# EAGLE design ee392 (EAGLE 5.01)
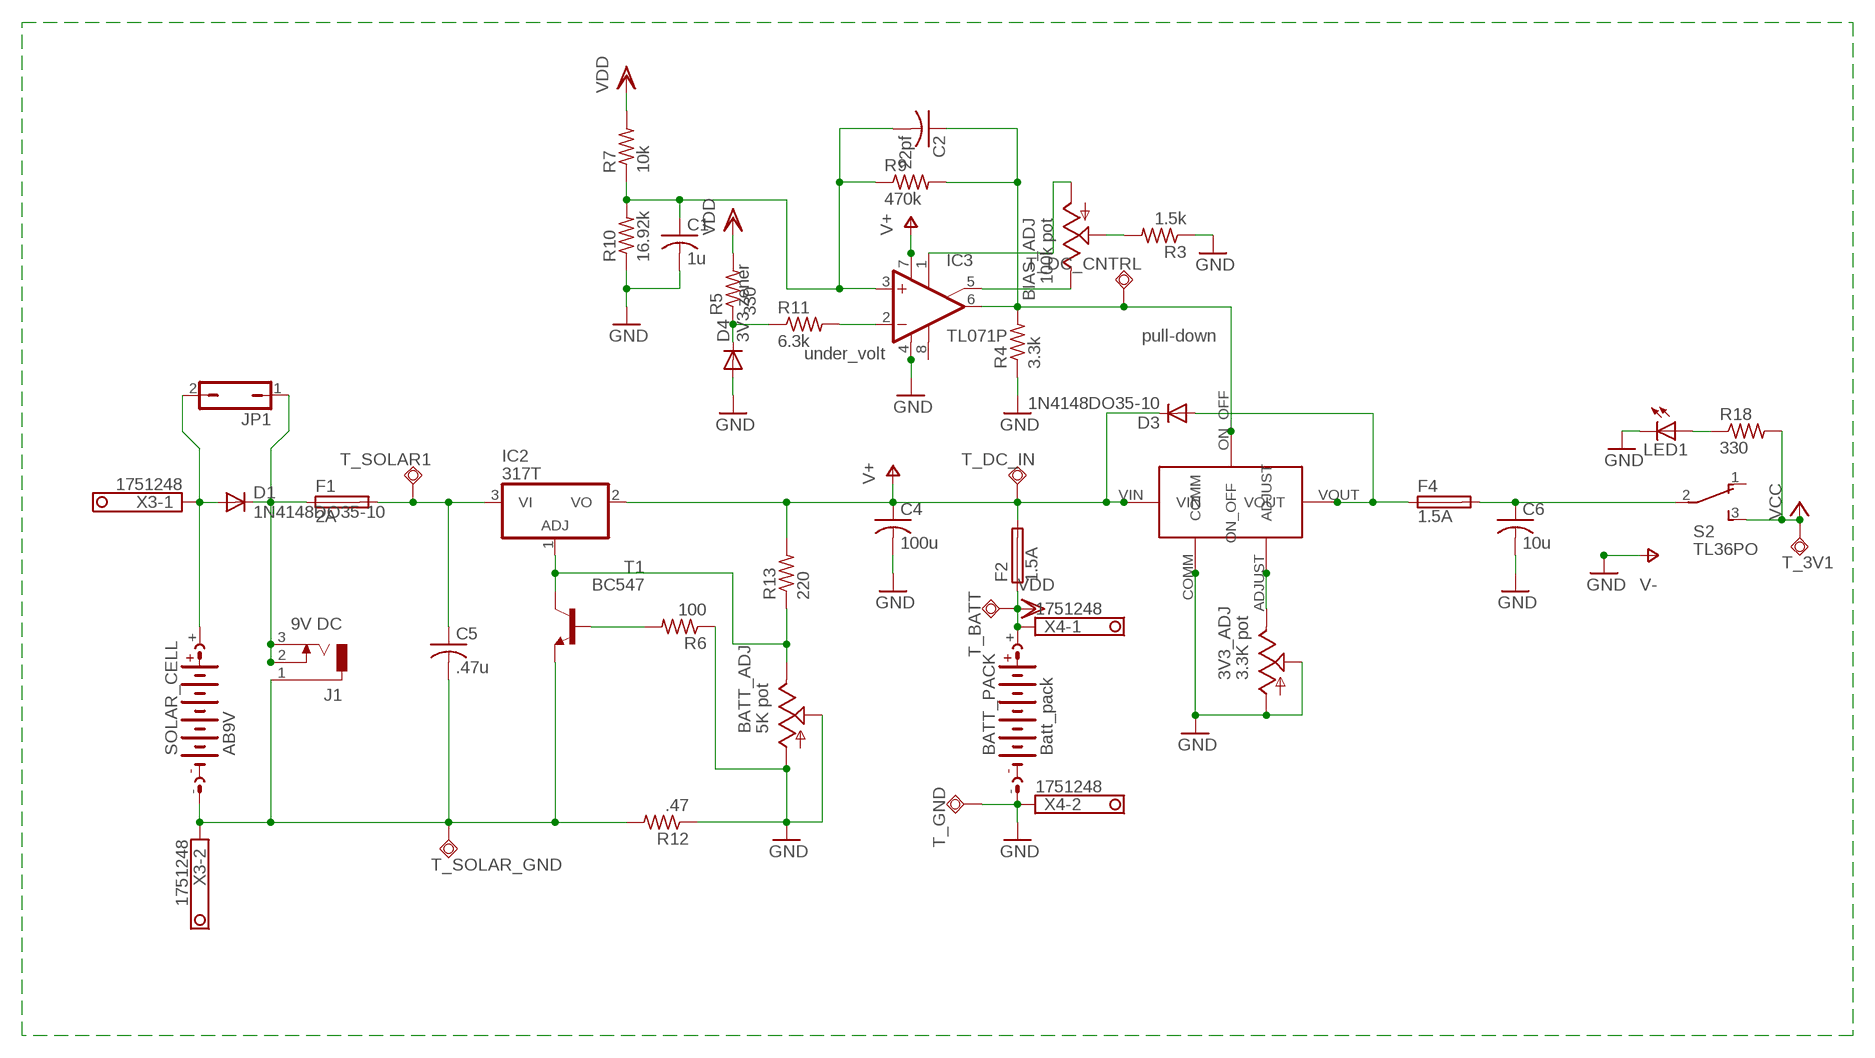
[diagram p0: schematic, sheet 1, part 1 of 2]
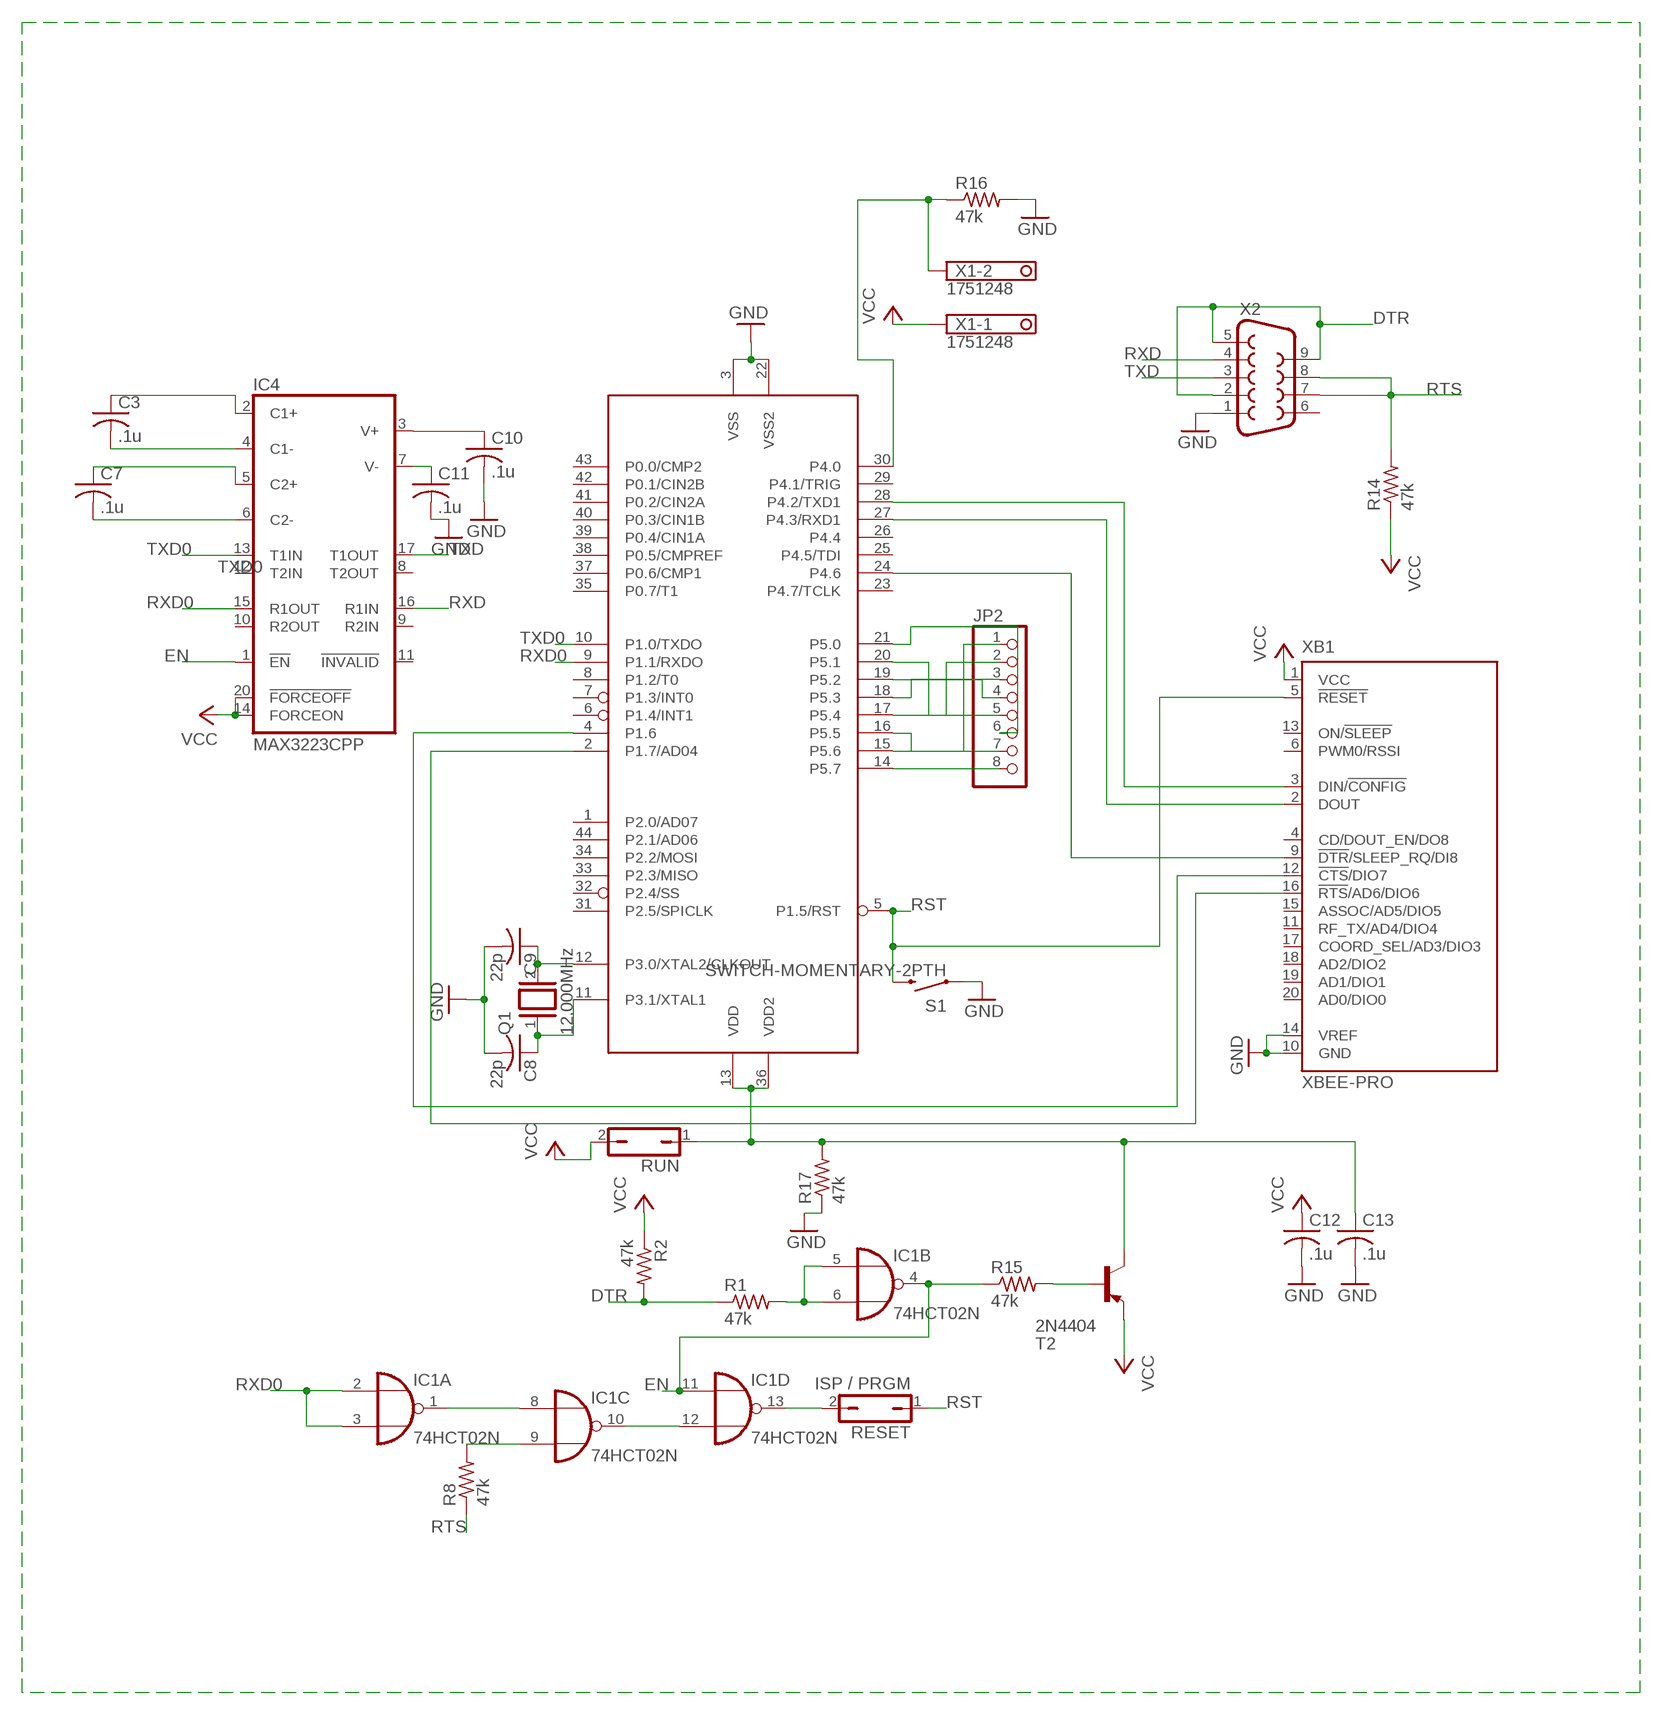
[diagram p1: schematic, sheet 1, part 2 of 2]

## Parts
3V3_ADJ  3.3K pot  TRIM_US-B25V  [B25V]
BATT_ADJ  5K pot  TRIM_US-B25V  [B25V]
BATT_PACK  Batt_pack  AB9V  [AB9V]
BIAS_ADJ  100k pot  TRIM_US-B25V  [B25V]
C1  1u  C-US050-045X075  [C050-045X075]
C2  22pf  C-US025-050X050  [C025-050X050]
C3  .1u  C-US025-050X050  [C025-050X050]
C4  100u  C-US050-045X075  [C050-045X075]
C5  .47u  C-US025-050X050  [C025-050X050]
C6  10u  C-US050-045X075  [C050-045X075]
C7  .1u  C-US025-050X050  [C025-050X050]
C8  22p  C-US025-050X050  [C025-050X050]
C9  22p  C-US025-050X050  [C025-050X050]
C10  .1u  C-US025-050X050  [C025-050X050]
C11  .1u  C-US025-050X050  [C025-050X050]
C12  .1u  C-US025-050X050  [C025-050X050]
C13  .1u  C-US025-050X050  [C025-050X050]
D1  1N4148DO35-10  [DO35-10]
D3  1N4148DO35-10  [DO35-10]
D4  3V3 zener  DIODE-DO35-10  [DO35-10]
F1  2A  FUSE19560  [19560]
F2  1.5A  FUSE19560  [19560]
F4  1.5A  FUSE19560  [19560]
IC1  74HCT02N  [DIL14]
IC2  317T  [TO220H]
IC3  TL071P  [DIL08]
IC4  MAX3223CPP  [DIL20]
J1  9V DC  DCJ0202  [DCJ0202]
JP1  JP1Q  [JP1]
JP2  PINHD-1X8  [1X08]
LED1  LED5MM  [LED5MM]
Q1  12.000MHz  XTAL/S  [QS]
R1  47k  R-US_0204/7  [0204/7]
R2  47k  R-US_0204/7  [0204/7]
R3  1.5k  R-US_0204/7  [0204/7]
R4  3.3k  R-US_0204/7  [0204/7]
R5  330  R-US_0204/7  [0204/7]
R6  100  R-US_0204/7  [0204/7]
R7  10k  R-US_0204/7  [0204/7]
R8  47k  R-US_0204/7  [0204/7]
R9  470k  R-US_0204/7  [0204/7]
R10  16.92k  R-US_0204/7  [0204/7]
R11  6.3k  R-US_0204/7  [0204/7]
R12  .47  R-US_0204/7  [0204/7]
R13  220  R-US_0204/7  [0204/7]
R14  47k  R-US_0204/7  [0204/7]
R15  47k  R-US_0204/7  [0204/7]
R16  47k  R-US_0204/7  [0204/7]
R17  47k  R-US_0204/7  [0204/7]
R18  330  R-US_0204/7  [0204/7]
RESET  ISP / PRGM  JP1Q  [JP1]
RUN  JP1Q  [JP1]
S1  SWITCH-MOMENTARY-2PTH  [TACTILE-PTH]
S2  TL36PO  [TL3XPO]
SOLAR_CELL  AB9V  [AB9V]
T1  BC547  [TO92]
T2  2N4404  -PNP-TO92-EBC  [TO92-EBC]
T_3V1  TPSQPAD1-20  [P1-20]
T_BATT  TPSQPAD1-20  [P1-20]
T_DC_CNTRL  TPSQPAD1-20  [P1-20]
T_DC_IN  TPSQPAD1-20  [P1-20]
T_GND  TPSQPAD1-20  [P1-20]
T_SOLAR1  TPSQPAD1-20  [P1-20]
T_SOLAR_GND  TPSQPAD1-20  [P1-20]
U$1  LPC954  [LPC954]
U$2  V_REG2  [V_REG2]
X1  1751248  [1751248]
X2  DB9MALE  [DB9]
X3  1751248  [1751248]
X4  1751248  [1751248]
XB1  XBEE-PRO  [XBEE-PRO]

## Nets
DTR: R1.1 R2.2 X2.2 X2.5 X2.9
EN: IC1.4(B:O) IC1.11(D:I0) IC4.1(!EN) R15.1
GND: 3V3_ADJ.A 3V3_ADJ.S BATT_ADJ.A BATT_ADJ.S BATT_PACK.- C1.2 C4.2 C6.2 C8.2 C9.2 C10.2 C11.2 C12.2 C13.2 D4.A IC3.4(V-) LED1.K(C) R3.1 R4.1 R6.1 R10.1 R12.1 R16.2 R17.1 S1.1 T_GND.1(TP) U$1.3(VSS) U$1.22(VSS2) U$2.COMM X2.1 X4.2 XB1.10(GND) XB1.14(VREF) ; supply symbol labelled V-
N$1: C5.2 J1.1 R12.2 SOLAR_CELL.- T1.1(E) T_SOLAR_GND.1(TP) X3.2
N$2: D1.A JP1.2 SOLAR_CELL.+ X3.1
N$3: D1.C F1.1 J1.2 J1.3 JP1.1
N$4: BIAS_ADJ.S R3.2
N$5: BIAS_ADJ.E IC3.5(ON2)
N$6: C1.1 C2.2 IC3.3(+IN) R7.1 R9.1 R10.2
N$7: IC3.2(-IN) R11.2
N$8: BIAS_ADJ.A IC3.1(ON1)
N$9: D4.C R5.1 R11.1
N$10: C3.1 IC4.2(C1+)
N$11: C5.1 F1.2 IC2.3(VI) T_SOLAR1.1(TP)
N$12: C3.2 IC4.4(C1-)
N$13: JP2.6 U$1.21(P5.0)
N$14: BATT_ADJ.E IC2.1(ADJ) R13.1 T1.3(C)
N$15: R6.2 T1.2(B)
N$16: C7.1 IC4.5(C2+)
N$17: C7.2 IC4.6(C2-)
N$18: IC1.1(A:O) IC1.8(C:I0)
N$19: IC1.9(C:I1) R8.2
N$20: IC1.10(C:O) IC1.12(D:I1)
N$21: IC1.13(D:O) RESET.2
N$22: IC1.5(B:I0) IC1.6(B:I1) R1.2
N$23: C13.1 R17.2 RUN.1 T2.C U$1.13(VDD) U$1.36(VDD2)
N$24: R15.2 T2.B
N$26: C9.1 Q1.2 U$1.12(P3.0/XTAL2/CLKOUT)
N$27: C8.1 Q1.1 U$1.11(P3.1/XTAL1)
N$29: C10.1 IC4.3(V+)
N$30: C11.1 IC4.7(V-)
N$31: U$1.28(P4.2/TXD1) XB1.3(DIN/!CONFIG)
N$32: U$1.27(P4.3/RXD1) XB1.2(DOUT)
N$33: R16.1 U$1.30(P4.0) X1.2
N$34: JP2.5 U$1.20(P5.1)
N$35: JP2.4 U$1.19(P5.2)
N$36: JP2.3 U$1.18(P5.3)
N$37: JP2.2 U$1.17(P5.4)
N$38: JP2.7 U$1.16(P5.5)
N$39: JP2.1 U$1.15(P5.6)
N$40: JP2.8 U$1.14(P5.7)
N$42: U$1.24(P4.6) XB1.9(!DTR!/SLEEP_RQ/DI8)
N$43: U$1.2(P1.7/AD04) XB1.16(!RTS!/AD6/DIO6)
N$44: U$1.4(P1.6) XB1.12(!CTS!/DIO7)
N$45: LED1.A R18.1
N$46: C6.1 F4.2 S2.2(P)
ON_OFF: C2.1 IC3.6(OUT) R4.2 R9.2 T_DC_CNTRL.1(TP) U$2.ON_OFF
R_TRIMM: 3V3_ADJ.E U$2.ADJUST
RST: RESET.1 S1.3 U$1.5(P1.5/RST) XB1.5(!RESET)
RTS: R8.1 R14.2 X2.7 X2.8
RXD: IC4.16(R1IN) X2.4
RXD0: IC1.2(A:I0) IC1.3(A:I1) IC4.15(R1OUT) U$1.9(P1.1/RXDO)
TXD: IC4.17(T1OUT) X2.3
TXD0: IC4.13(T1IN) U$1.10(P1.0/TXDO)
V+: C4.1 D3.C F2.2 IC2.2(VO) IC3.7(V+) R13.2 T_DC_IN.1(TP) U$2.VIN
VCC: C12.1 IC4.14(FORCEON) IC4.20(!FORCEOFF) R2.1 R14.1 R18.2 RUN.2 S2.3(S) T2.E T_3V1.1(TP) X1.1 XB1.1(VCC)
VDD: BATT_PACK.+ F2.1 R5.2 R7.2 T_BATT.1(TP) X4.1
VOUT: D3.A F4.1 U$2.VOUT
Unconnected: IC3.8(OPT) IC4.8(T2OUT) IC4.9(R2IN) IC4.10(R2OUT) IC4.11(!INVALID) IC4.12(T2IN) S2.1(O) U$1.1(P2.0/AD07) U$1.6(P1.4/INT1) U$1.7(P1.3/INT0) U$1.8(P1.2/T0) U$1.23(P4.7/TCLK) U$1.25(P4.5/TDI) U$1.26(P4.4) U$1.29(P4.1/TRIG) U$1.31(P2.5/SPICLK) U$1.32(P2.4/SS) U$1.33(P2.3/MISO) U$1.34(P2.2/MOSI) U$1.35(P0.7/T1) U$1.37(P0.6/CMP1) U$1.38(P0.5/CMPREF) U$1.39(P0.4/CIN1A) U$1.40(P0.3/CIN1B) U$1.41(P0.2/CIN2A) U$1.42(P0.1/CIN2B) U$1.43(P0.0/CMP2) U$1.44(P2.1/AD06) X2.6 XB1.4(CD/DOUT_EN/DO8) XB1.6(PWM0/RSSI) XB1.11(RF_TX/AD4/DIO4) XB1.13(ON/!SLEEP) XB1.15(ASSOC/AD5/DIO5) XB1.17(COORD_SEL/AD3/DIO3) XB1.18(AD2/DIO2) XB1.19(AD1/DIO1) XB1.20(AD0/DIO0)

## Notes on the sheet
- pull-down
- under_volt

## Power pins joined to a net without a drawn wire
GND: IC1.7(P:GND) IC4.18(GND)
VCC: IC1.14(P:VCC) IC4.19(VCC)

## Library data of the parts
3V3_ADJ BATT_ADJ BIAS_ADJ = pot:TRIM_US-: POTENTIOMETER
BATT_PACK SOLAR_CELL = battery:AB9V: 9-V BATTERY CLIP
C1-C13 = rcl:C-US: CAPACITOR, American symbol
D1 D3 = diode:1N4148: DIODE high speed (Philips)
D4 = diode:DIODE-: DIODE
F1 F2 F4 = fuse:FUSE: Fuse
IC1 = 74xx-eu:74*02: Quad 2-input NOR gate
IC2 = linear:*317: Positive VOLTAGE REGULATOR
IC3 = linear:TL071: OP AMP
IC4 = maxim:MAX3223*: RS-232 Transceivers with AutoShutdown 1µA Supply-Current, True +3V to +5.5V http://dbserv.maxim-ic.com/
J1 = con-jack:DCJ0202: DC POWER JACK Source: DCJ0202.pdf
JP1 RESET RUN = jumper:JP1Q: JUMPER
JP2 = pinhead:PINHD-1X8: PIN HEADER
LED1 = led:LED: LED OSRAM: - CHIPLED LG R971, LG N971, LY N971, LG Q971, LY Q971, LO R971, LY R971 LH N974, LH R974 LS Q976, LO Q976, LY Q976 LO Q996 - Hyper CHIPLED LW Q18S LB Q993, LB Q99A, LB R99A - SideLED LS A670, LO A670, LY A670, LG A670, LP A670 LB A673, LV A673, LT A673, LW A673 LH A674 LY A675 LS A676, LA A676, LO A676, LY A676, LW A676 LS A679, LY A679, LG A679 - Hyper Micro SIDELED® LS Y876, LA Y876, LO Y876, LY Y876 LT Y87S - SmartLED LW L88C, LW L88S LB L89C, LB L89S, LG L890 LS L89K, LO L89K, LY L89K LS L896, LA L896, LO L896, LY L896 - TOPLED LS T670, LO T670, LY T670, LG T670, LP T670 LSG T670, LSP T670, LSY T670, LOP T670, LYG T670 LG T671, LOG T671, LSG T671 LB T673, LV T673, LT T673, LW T673 LH T674 LS T676, LA T676, LO T676, LY T676, LB T676, LH T676, LSB T676, LW T676 LB T67C, LV T67C, LT T67C, LS T67K, LO T67K, LY T67K, LW E67C LS E67B, LA E67B, LO E67B, LY E67B, LB E67C, LV E67C, LT E67C LW T67C LS T679, LY T679, LG T679 LS T770, LO T770, LY T770, LG T770, LP T770 LB T773, LV T773, LT T773, LW T773 LH T774 LS E675, LA E675, LY E675, LS T675 LS T776, LA T776, LO T776, LY T776, LB T776 LHGB T686 LT T68C, LB T68C - Hyper Mini TOPLED® LB M676 - Mini TOPLED Santana® LG M470 LS M47K, LO M47K, LY M47K Source: http://www.osram.convergy.de LUXEON: - LUMILED® LXK2-PW12-R00, LXK2-PW12-S00, LXK2-PW14-U00, LXK2-PW14-V00 LXK2-PM12-R00, LXK2-PM12-S00, LXK2-PM14-U00 LXK2-PE12-Q00, LXK2-PE12-R00, LXK2-PE12-S00, LXK2-PE14-T00, LXK2-PE14-U00 LXK2-PB12-K00, LXK2-PB12-L00, LXK2-PB12-M00, LXK2-PB14-N00, LXK2-PB14-P00, LXK2-PB14-Q00 LXK2-PR12-L00, LXK2-PR12-M00, LXK2-PR14-Q00, LXK2-PR14-R00 LXK2-PD12-Q00, LXK2-PD12-R00, LXK2-PD12-S00 LXK2-PH12-R00, LXK2-PH12-S00 LXK2-PL12-P00, LXK2-PL12-Q00, LXK2-PL12-R00 Source: www.luxeon.com KINGBRIGHT: KA-3528ASYC Source: www.kingbright.com
Q1 = special:XTAL/S: CRYSTAL
R1-R18 = resistor:R-US_: RESISTOR, American symbol
S1 = SparkFun:SWITCH-MOMENTARY-2
S2 = switch:TL36PO: TINY SWITCH ON - ON Source: http://www2.produktinfo.conrad.com/datenblaetter/700000-724999/705152-da-01-de-Subminiaturschalter_TL_36YO.pdf
T1 = transistor:BC547: NPN TRANSISTOR
T2 = transistor-neu-to92:*-PNP-: PNP Transistror
T_3V1 T_BATT T_DC_CNTRL T_DC_IN T_GND T_SOLAR1 T_SOLAR_GND = testpad:TPSQ: Test pad
U$1 = lpc954:LPC954
U$2 = murata-v_reg2:V_REG2
X1 X3 X4 = con-phoenix-350:1751248: MKDS 1/ 2-3,5 Printklemme Nennstrom: 10 A Bemessungsspannung: 160 V Raster: 3,5 mm Polzahl: 2 Montageart: Löten Anschlussart: Schraubanschluss Anschlussrichtung vom Leiter zur Platine: 0° Source: http://eshop.phoenixcontact.com .. 1751248.pdf
X2 = SparkFun:DB9: DB9 Connector Standard DB9 (D-Sub 9) serial connector. Can be used for CAN bus as well as RS485 and RS232. Footprint production proven. Spark Fun Electronics SKU : PRT-00429
XB1 = maxstream:XBEE: XBee (TM) /XBee-PRO(TM) OEM RF Modules Source: MaxStream, Inc. xbee_productmanual.pdf

## Board
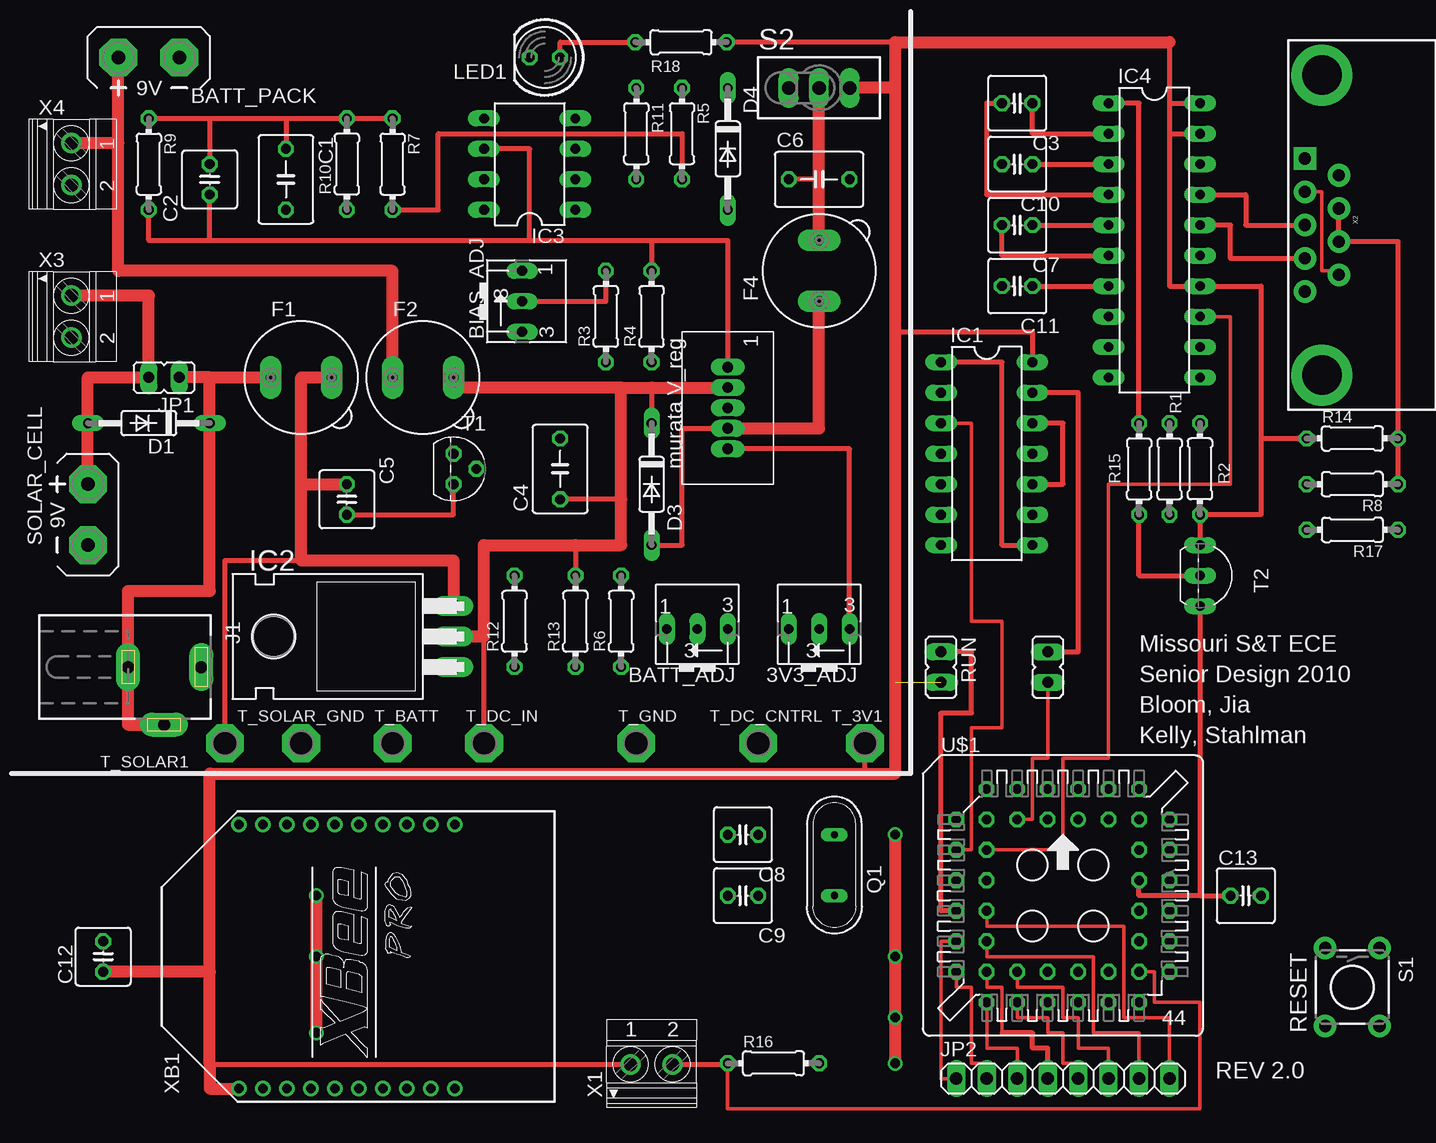
[diagram p2: board, top side]
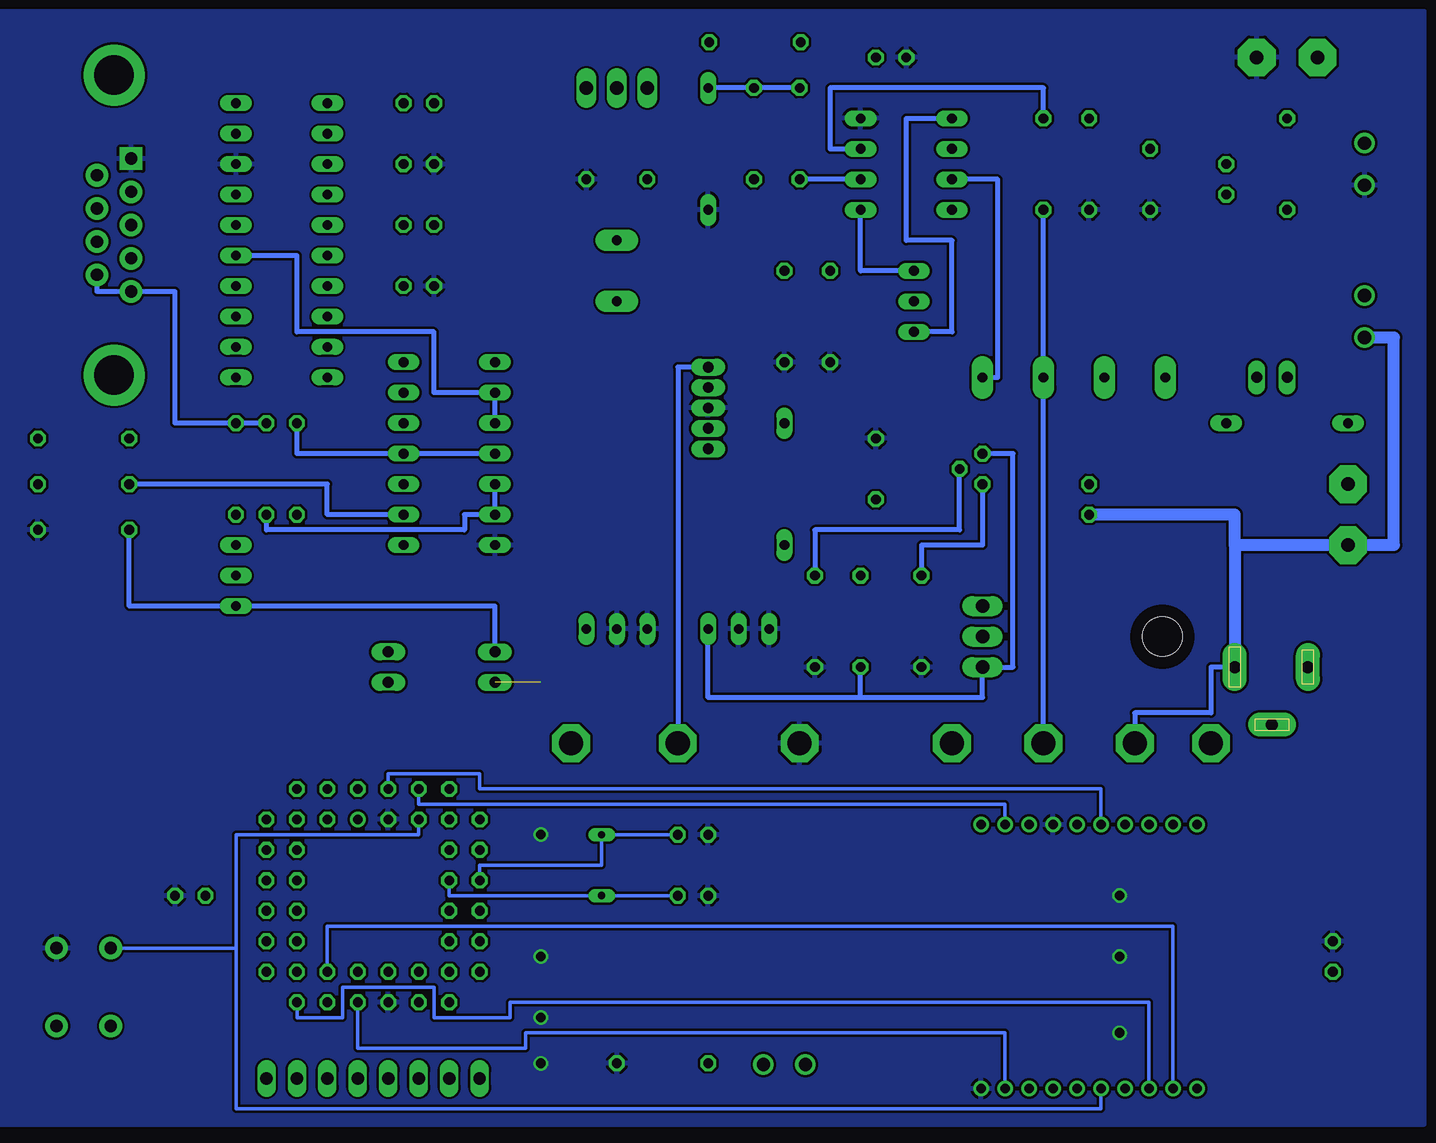
[diagram p3: board, bottom side, seen from below]

No outline drawn. Coordinates in mm, seen from the top.
Copper layers (1*16): Top 0.035mm / dielectric 1.5mm / Bottom 0.035mm
Design rules "default": minimum track width 10mil, minimum drill 24mil, track to track 8mil, track to pad 8mil, pad to pad 8mil, via to via 8mil, smd to smd 8mil, copper to edge 40mil, drill to drill 8mil, minimum pad ring 10mil, minimum via ring 8mil, stop-mask expansion 4mil, vias tented up to drill 0mil, thermal gap 10mil

### Footprints (pad centres in the part's own frame; a part is rotated, then mirrored left to right if it is on the bottom)
B25V = drill 0.813 long: A 2.54,0.635; E -2.54,0.635; S 0,0.635
AB9V = drill 1.118 pad 3.15 octagon: + 0,2.54; - 0,-2.54
C050-045X075 = drill 0.813 octagon: 1 -2.54,0; 2 2.54,0
C025-050X050 = drill 0.813 octagon: 1 -1.27,0; 2 1.27,0
DO35-10 = drill 0.813 long: A 5.08,0; C -5.08,0
19560 = drill 0.813 pad 1.778 long: 1 -2.54,0; 2 2.54,0
DIL14 = drill 0.813 long: 1 -7.62,-3.81; 2 -5.08,-3.81; 3 -2.54,-3.81; 4 0,-3.81; 5 2.54,-3.81; 6 5.08,-3.81; 7 7.62,-3.81; 8 7.62,3.81; 9 5.08,3.81; 10 2.54,3.81; 11 0,3.81; 12 -2.54,3.81; 13 -5.08,3.81; 14 -7.62,3.81
TO220H = drill 1.118 long: 1 -2.54,-10.16; 2 0,-10.16; 3 2.54,-10.16 | hole 3.302: 0,4.826
DIL08 = drill 0.813 long: 1 -3.81,-3.81; 2 -1.27,-3.81; 3 1.27,-3.81; 4 3.81,-3.81; 5 3.81,3.81; 6 1.27,3.81; 7 -1.27,3.81; 8 -3.81,3.81
DIL20 = drill 0.813 long: 1 -11.43,-3.81; 2 -8.89,-3.81; 3 -6.35,-3.81; 4 -3.81,-3.81; 5 -1.27,-3.81; 6 1.27,-3.81; 7 3.81,-3.81; 8 6.35,-3.81; 9 8.89,-3.81; 10 11.43,-3.81; 11 11.43,3.81; 12 8.89,3.81; 13 6.35,3.81; 14 3.81,3.81; 15 1.27,3.81; 16 -1.27,3.81; 17 -3.81,3.81; 18 -6.35,3.81; 19 -8.89,3.81; 20 -11.43,3.81
DCJ0202 = drill 1 pad 2 long: 1 0,3.1; 2 4.8,0; 3 0,-3
JP1 = drill 0.914 long: 1 0,-1.27; 2 0,1.27
1X08 = drill 1.016 long: 1 -8.89,0; 2 -6.35,0; 3 -3.81,0; 4 -1.27,0; 5 1.27,0; 6 3.81,0; 7 6.35,0; 8 8.89,0
LED5MM = drill 0.813 octagon: A -1.27,0; K 1.27,0
QS = drill 0.61 long: 1 -2.54,0; 2 2.54,0
0204/7 = drill 0.813 octagon: 1 -3.81,0; 2 3.81,0
TACTILE-PTH = drill 1.016 pad 1.88 round: 1 -3.251,2.261; 2 3.251,2.261; 3 -3.251,-2.261; 4 3.251,-2.261
TL3XPO = drill 1.1 pad 1.422 long: 1 -2.54,0; 2 0,0; 3 2.54,0
TO92 = drill 0.813 octagon: 1 1.27,0; 2 0,1.905; 3 -1.27,0
TO92-EBC = drill 0.813 long: B 0,-1.27; C 2.54,-1.27; E -2.54,-1.27
P1-20 = drill 2.007 pad 3.15 octagon: 1 0,0
LPC954 = drill 0.813 round: 1 1.27,6.35 | drill 0.813 octagon: 2 -1.27,8.89; 3 -1.27,6.35; 4 -3.81,8.89; 5 -3.81,6.35; 6 -6.35,8.89; 7 -8.89,6.35; 8 -6.35,6.35; 9 -8.89,3.81; 10 -6.35,3.81; 11 -8.89,1.27; 12 -6.35,1.27; 13 -8.89,-1.27; 14 -6.35,-1.27; 15 -8.89,-3.81; 16 -6.35,-3.81; 17 -8.89,-6.35; 18 -6.35,-8.89; 19 -6.35,-6.35; 20 -3.81,-8.89; 21 -3.81,-6.35; 22 -1.27,-8.89; 23 -1.27,-6.35; 24 1.27,-8.89; 25 1.27,-6.35; 26 3.81,-8.89; 27 3.81,-6.35; 28 6.35,-8.89; 29 8.89,-6.35; 30 6.35,-6.35; 31 8.89,-3.81; 32 6.35,-3.81; 33 8.89,-1.27; 34 6.35,-1.27; 35 8.89,1.27; 36 6.35,1.27; 37 8.89,3.81; 38 6.35,3.81; 39 8.89,6.35; 40 6.35,8.89; 41 6.35,6.35; 42 3.81,8.89; 43 3.81,6.35; 44 1.27,8.89
V_REG2 = drill 0.9 pad 1.27 long: ADJUST -3.4,0; COMM 0,0; ON_OFF 3.4,0; VIN 1.7,0; VOUT -1.7,0
1751248 = drill 1.1 pad 1.7 round: 1 -1.75,-0.1; 2 1.75,-0.1
DB9 = drill 1.016 pad 1.88 square: 1 -5.54,-1.42 | drill 1.016 pad 1.88 round: 2 -2.77,-1.42; 3 0,-1.42; 4 2.77,-1.42; 5 5.54,-1.42; 6 -4.15,1.42; 7 -1.38,1.42; 8 1.38,1.42; 9 4.15,1.42 | drill 3.302 pad 5.08 round: G1 -12.5,0; G2 12.5,0
XBEE-PRO = drill 0.8 pad 1.27 round: 1 -11,9; 2 -11,7; 3 -11,5; 4 -11,3; 5 -11,1; 6 -11,-1; 7 -11,-3; 8 -11,-5; 9 -11,-7; 10 -11,-9; 11 11,-9; 12 11,-7; 13 11,-5; 14 11,-3; 15 11,-1; 16 11,1; 17 11,3; 18 11,5; 19 11,7; 20 11,9

### Placement (x,y rotation side)
3V3_ADJ  71.12,15.24 180 top
BATT_ADJ  60.96,15.24 180 top
BATT_PACK  15.24,62.23 90 top
BIAS_ADJ  46.99,41.91 90 top
C1  26.67,52.07 270 top
C2  20.32,52.07 90 top
C3  87.63,58.42 180 top
C4  49.53,27.94 90 top
C5  31.75,25.4 270 top
C6  71.12,52.07 0 top
C7  87.63,48.26 180 top
C8  64.77,-2.54 180 top
C9  64.77,-7.62 180 top
C10  87.63,53.34 180 top
C11  87.63,43.18 180 top
C12  11.43,-12.7 90 top
C13  106.68,-7.62 0 top
D1  15.24,31.75 180 top
D3  57.15,26.67 270 top
D4  63.5,54.61 270 top
F1  27.94,35.56 0 top
F2  38.1,35.56 0 top
F4  71.12,44.45 90 top
IC1  85.09,29.21 270 top
IC2  30.48,13.97 90 top
IC3  46.99,53.34 90 top
IC4  99.06,46.99 270 top
J1  16.51,11.43 270 top
JP1  16.51,35.56 90 top
JP2  91.44,-22.86 0 top
LED1  48.26,62.23 180 top
Q1  72.39,-5.08 270 top
R1  100.33,27.94 270 top
R2  102.87,27.94 90 top
R3  53.34,40.64 90 top
R4  57.15,40.64 90 top
R5  59.69,55.88 270 top
R6  54.61,15.24 90 top
R7  35.56,53.34 270 top
R8  115.57,26.67 180 top
R9  15.24,53.34 270 top
R10  31.75,53.34 90 top
R11  55.88,55.88 270 top
R12  45.72,15.24 90 top
R13  50.8,15.24 90 top
R14  115.57,30.48 0 top
R15  97.79,27.94 270 top
R16  67.31,-21.59 0 top
R17  115.57,22.86 180 top
R18  59.6,63.5 0 top
RESET  90.17,11.43 0 top
RUN  81.28,11.43 180 top
S1  115.57,-15.24 270 top
S2  71.12,59.69 0 top
SOLAR_CELL  10.16,24.13 0 top
T1  40.64,27.94 270 top
T2  104.14,19.05 270 top
T_3V1  74.93,5.08 0 top
T_BATT  35.56,5.08 0 top
T_DC_CNTRL  66.04,5.08 0 top
T_DC_IN  43.18,5.08 0 top
T_GND  55.88,5.08 0 top
T_SOLAR1  21.59,5.08 0 top
T_SOLAR_GND  27.94,5.08 0 top
U$1  91.44,-7.62 0 top
U$2  63.5,33.02 90 top
X1  57.15,-21.59 0 top
X2  113.03,48.26 270 top
X3  8.89,40.64 270 top
X4  8.89,53.34 270 top
XB1  31.75,-12.7 90 top

### Tracks (layer width: path | path; a pad name or v marks a point on that pad's centre or on a via)
DTR
  Top 0.305: X2.2 113.03,51.03 113.03,44.45 114.45,44.45
  Top 0.406: X2.9 114.45,44.45
  Bottom 0.406: R1.1 R2.2 107.95,31.75 107.95,42.72 X2.5 114.45,42.72 X2.9
EN
  Top 0.406: IC4.1 97.79,58.42 R15.1
  Bottom 0.406: IC1.4 IC1.11 97.79,29.21 R15.1
GND  (via drill 0.8)
  Top 1.016: v29.21,-7.62 v29.21,-12.7 v29.21,-19.05 | v77.47,-21.59 v77.47,-2.54
  other vias: 77.47,-12.7 77.47,-17.78
  pour Bottom: 3.81,66.04 123.19,66.04 123.19,-26.67 3.81,-26.67
N$1
  Top 0.406: T1.1 40.64,24.13 C5.2
  Bottom 0.406: T1.1 40.64,21.59 45.72,21.59 R12.2 | J1.1 21.59,11.43 21.59,7.62 27.94,7.62 T_SOLAR_GND.1
  Bottom 1.016: 19.61,21.59 J1.1 | 19.61,21.59 19.61,24.13 C5.2 | 19.61,21.59 SOLAR_CELL.- 6.35,21.59 6.35,38.89 X3.2
N$2
  Top 1.016: SOLAR_CELL.+ D1.A 10.16,35.56 JP1.2 15.24,42.39 X3.1
N$3
  Top 1.016: 20.32,35.56 JP1.1 | 20.32,35.56 D1.C 20.32,17.78 13.51,17.78 J1.3 13.51,6.63 J1.2 | 20.32,35.56 F1.1
N$4
  Top 0.406: R3.2 53.34,41.91 BIAS_ADJ.S
N$5
  Bottom 0.406: IC3.5 46.99,57.15 46.99,46.99 43.18,46.99 43.18,39.37 BIAS_ADJ.E
N$6
  Top 0.406: 26.67,57.15 C1.1 | 20.32,57.15 C2.2 | 20.32,57.15 26.67,57.15 | 26.67,57.15 R10.2 R7.1 | R9.1 20.32,57.15
  Bottom 0.406: R7.1 35.56,59.69 53.34,59.69 53.34,54.61 IC3.3
N$7
  Bottom 0.406: IC3.2 R11.2
N$8
  Bottom 0.406: BIAS_ADJ.A 50.8,44.45 IC3.1
N$9
  Bottom 0.406: R11.1 R5.1 D4.C
N$10
  Top 0.406: C3.1 88.9,55.88 IC4.2
N$11
  Top 0.406: T_SOLAR1.1 21.59,20.32 27.94,20.32
  Top 1.016: F1.2 27.94,35.56 27.94,26.67 | 27.94,26.67 27.94,20.32 40.64,20.32 IC2.3 | 27.94,26.67 C5.1
N$12
  Top 0.406: C3.2 85.09,58.42 85.09,50.8 IC4.4
N$13
  Top 0.305: U$1.21 87.63,-15.24 91.44,-15.24 91.44,-17.78 92.71,-17.78 92.71,-20.32 95.25,-20.32 JP2.6
N$14
  Bottom 0.406: T1.3 38.1,29.21 38.1,11.43 IC2.1 40.64,8.89 50.8,8.89 | 50.8,8.89 R13.1 | 50.8,8.89 63.5,8.89 BATT_ADJ.E
N$15
  Bottom 0.406: T1.2 42.55,22.86 54.61,22.86 R6.2
N$16
  Top 0.406: C7.1 IC4.5
N$17
  Top 0.406: C7.2 86.36,45.72 IC4.6
N$18
  Top 0.406: IC1.1 86.36,36.83 86.36,21.59 IC1.8
N$19
  Bottom 0.406: IC1.9 95.25,24.13 95.25,26.67 R8.2
N$20
  Top 0.406: IC1.12 91.44,31.75 91.44,26.67 IC1.10
N$21
  Top 0.406: IC1.13 92.71,34.29 92.71,12.7 RESET.2
N$22
  Bottom 0.406: IC1.5 IC1.6 83.82,24.13 83.82,22.86 100.33,22.86 R1.2
N$23
  Top 0.406: U$1.36 97.79,-7.62 102.87,-7.62 | T2.C 102.87,-7.62 | U$1.13 81.28,-8.89 81.28,7.62 83.82,7.62 83.82,12.7 RUN.1 | 102.87,-7.62 C13.1
  Bottom 0.406: R17.2 111.76,16.51 T2.C 81.28,16.51 RUN.1
N$24
  Top 0.406: R15.2 97.79,19.05 T2.B
N$26
  Bottom 0.305: C9.1 Q1.2 85.09,-7.62 U$1.12
N$27
  Bottom 0.305: C8.1 Q1.1 72.39,-5.08 82.55,-5.08 U$1.11
N$29
  Top 0.406: C10.1 IC4.3
N$30
  Top 0.406: C11.1 IC4.7
N$31
  Bottom 0.305: XB1.3 26.75,-16.51 80.01,-16.51 80.01,-17.78 86.36,-17.78 86.36,-15.24 93.98,-15.24 93.98,-17.78 97.79,-17.78 U$1.28
N$32
  Bottom 0.305: XB1.2 24.75,-10.16 95.25,-10.16 U$1.27
N$33
  Top 0.305: 63.5,-21.69 R16.1 63.5,-25.4 102.87,-25.4 102.87,-16.51 99.06,-16.51 99.06,-13.97 U$1.30
  Top 0.406: X1.2 63.5,-21.69
N$34
  Top 0.305: U$1.20 87.63,-17.78 90.17,-17.78 90.17,-19.05 91.44,-19.05 91.44,-21.59 92.71,-21.59 JP2.5
N$35
  Top 0.305: U$1.19 85.09,-15.24 86.36,-15.24 86.36,-19.05
  Top 0.406: 86.36,-19.05 88.9,-19.05 88.9,-20.32 90.17,-20.32 JP2.4
N$36
  Top 0.305: U$1.18 85.09,-20.32 87.63,-20.32 JP2.3
N$37
  Top 0.305: U$1.17 82.55,-15.24 83.82,-15.24 83.82,-21.59 85.09,-21.59 JP2.2
N$38
  Top 0.305: U$1.16 85.09,-12.7 93.98,-12.7 93.98,-19.05 97.79,-19.05 JP2.7
N$39
  Top 0.305: U$1.15 81.28,-11.43 81.28,-22.86 JP2.1
N$40
  Top 0.305: U$1.14 85.09,-10.16 96.52,-10.16 96.52,-17.78 100.33,-17.78 JP2.8
N$42
  Bottom 0.305: XB1.9 38.75,-19.05 78.74,-19.05 78.74,-20.32 92.71,-20.32 U$1.24
N$43
  Bottom 0.305: U$1.2 90.17,2.54 82.55,2.54 82.55,1.27 30.75,1.27 XB1.16
N$44
  Bottom 0.305: XB1.12 38.75,0 87.63,0 U$1.4
N$45
  Top 0.406: LED1.A 49.53,63.5 R18.1
N$46
  Top 0.406: 71.12,52.07 C6.1
  Top 1.016: F4.2 71.12,52.07 S2.2
ON_OFF
  Top 0.406: IC3.6 46.99,54.61 46.99,46.99 | 46.99,46.99 57.15,46.99 | U$2.ON_OFF 63.5,46.99 57.15,46.99 | 57.15,46.99 R4.2 | R9.2 15.24,46.99 20.32,46.99 | 20.32,46.99 46.99,46.99 | 20.32,46.99 C2.1
  Bottom 0.406: U$2.ON_OFF 66.04,36.42 T_DC_CNTRL.1
R_TRIMM
  Top 0.406: U$2.ADJUST 73.66,29.62 3V3_ADJ.E
RST
  Top 0.305: U$1.5 88.9,-1.27 88.9,3.81 90.17,3.81 RESET.1
  Bottom 0.305: XB1.5 30.75,-25.4 102.87,-25.4 102.87,-11.99 | U$1.5 87.63,-2.54 102.87,-2.54 102.87,-11.99 | 102.87,-11.99 S1.3
RTS
  Top 0.406: R8.1 R14.2 119.38,46.88 X2.8 X2.7
RXD
  Top 0.406: X2.4 105.41,45.49 105.41,48.26 IC4.16
RXD0
  Top 0.305: IC1.3 83.82,31.75 83.82,15.24 86.36,15.24 86.36,6.35 83.82,6.35 83.82,-3.81 U$1.9
  Bottom 0.406: IC1.3 IC1.2 86.36,34.29 86.36,39.37 97.79,39.37 97.79,45.72 IC4.15
TXD
  Top 0.406: 102.87,51.03 IC4.17 106.68,50.8 106.68,48.26 X2.3
TXD0
  Top 0.305: IC4.13 105.41,40.64 105.41,26.67 95.25,26.67 95.25,3.81 91.44,3.81 91.44,-3.81 U$1.10
V+
  Top 0.406: 57.15,34.72 D3.C | 54.61,25.4 C4.1 | 50.8,21.59 R13.2 | T_DC_IN.1 43.18,13.97
  Top 1.016: 54.61,34.72 57.15,34.72 U$2.VIN | 54.61,34.72 54.61,25.4 54.61,21.59 50.8,21.59 43.18,21.59 43.18,13.97 IC2.2 | 54.61,34.72 40.64,34.72 F2.2
  Bottom 0.406: F2.2 39.37,35.56 39.37,52.07 IC3.7
VCC  (1 unrouted)
  Top 0.406: 100.33,55.88 100.33,43.18 IC4.14 107.95,43.18 107.95,30.48 | 100.33,55.88 IC4.19 | 100.33,63.5 100.33,58.42 | 100.33,58.42 100.33,55.88 | 107.95,30.48 R14.1 | 107.95,30.48 107.95,24.13 R2.1 T2.E | 20.32,-21.69 X1.1 | IC1.14 88.9,39.37 77.47,39.37 | 74.93,2.54 T_3V1.1 | 100.33,58.42 IC4.20 | 77.47,63.5 R18.2
  Top 1.016: 100.33,63.5 77.47,63.5 77.47,59.69 | 77.47,59.69 77.47,39.37 77.47,10.16 77.47,2.54 74.93,2.54 20.32,2.54 20.32,-13.97 | XB1.1 20.32,-23.7 20.32,-21.69 20.32,-13.97 | 77.47,59.69 S2.3 | 20.32,-13.97 C12.1
VDD
  Top 0.406: R7.2 39.37,49.53 39.37,55.88 59.69,55.88 R5.2
  Top 1.016: 12.7,55.09 X4.1 | 12.7,55.09 12.7,44.45 35.56,44.45 F2.1 | 12.7,55.09 BATT_PACK.+
  Bottom 0.406: T_BATT.1 F2.1 R7.2
VOUT
  Top 0.406: D3.A 59.69,21.59 59.69,31.32 U$2.VOUT
  Top 1.016: F4.1 71.12,31.32 U$2.VOUT

### Text on the board
tNames: Missouri S&T ECE | Senior Design 2010 | Bloom, Jia | Kelly, Stahlman | RESET | REV 2.0